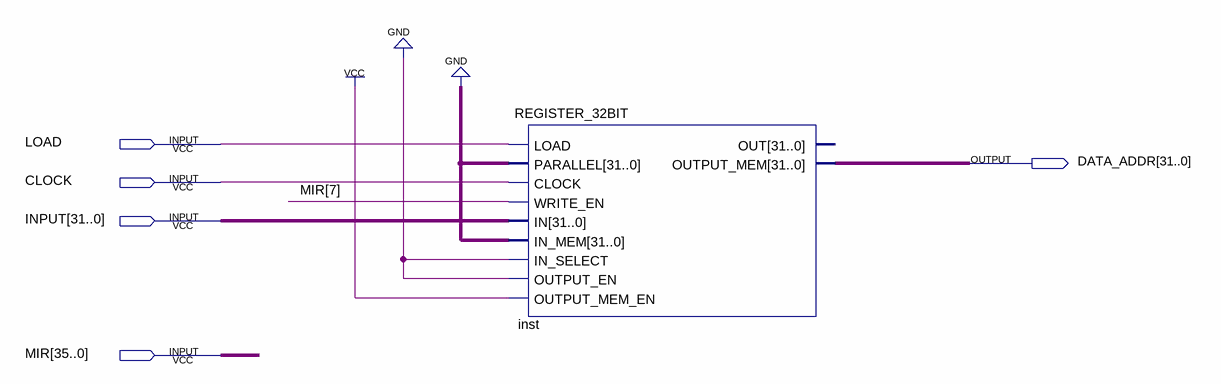
[diagram p0: schematic sheet]
// Quartus schematic MAR.bdf as structural Verilog: 1 symbols, 5 pins
module MAR (
  input  LOAD,
  input  CLOCK,
  input  [31:0] INPUT,
  input  [35:0] MIR,
  output [31:0] DATA_ADDR
);

  REGISTER_32BIT inst (
    .LOAD(LOAD), .PARALLEL({32{1'b0}}), .CLOCK(CLOCK), .WRITE_EN(MIR[7]), .IN(INPUT), .IN_MEM({32{1'b0}}),
    .IN_SELECT(1'b0), .OUTPUT_EN(1'b0), .OUTPUT_MEM_EN(1'b1), .OUTPUT_MEM(DATA_ADDR));  // open: OUT
endmodule
